# EAGLE design NullAnalyser (EAGLE 5.11)
MPN: C2012Y5V1C105Z/0.85; OC_NEWARK: 90R7762
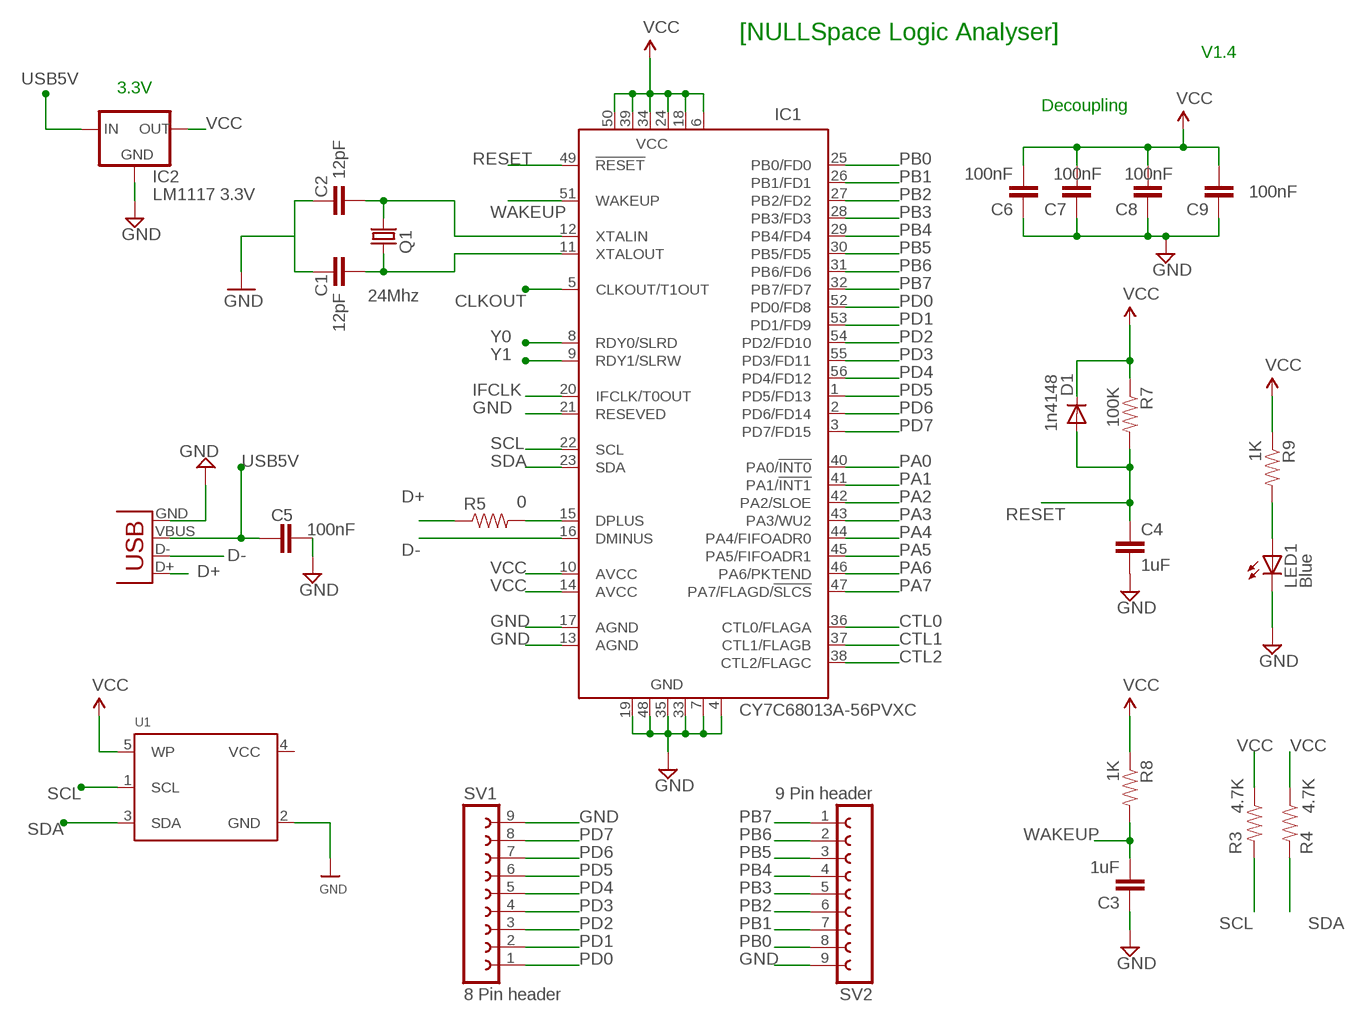
[diagram p0: schematic, sheet 1]

## Parts
C1  12pF  CAP0805  [0805]
C2  12pF  CAP0805  [0805]
C3  1uF  CAP0805  [0805]
C4  1uF  CAP0805  [0805]
C5  100nF  CAP0805  [0805]
C6  100nF  CAP0805  [0805]
C7  100nF  CAP0805  [0805]
C8  100nF  CAP0805  [0805]
C9  100nF  CAP0805  [0805]
D1  1n4148  DIODESOD  [SOD-323]
IC1  CY7C68013A-56PVXC  [SSOP56]
IC2  LM1117 3.3V  LM1117  [SOT223]
LED1  Blue  LED1206  [LED-1206]
Q1  24Mhz  CRYSTALTWO-PADTWO-PAD  [CRYSTAL-SMD-TWO-PAD]
R3  4.7K  RESISTOR  [0805]
R4  4.7K  RESISTOR  [0805]
R5  0  RESISTOR1206  [1206]
R7  100K  RESISTOR  [0805]
R8  1K  RESISTOR  [0805]
R9  1K  RESISTOR  [0805]
SV1  8 Pin header  FE09-1  [FE09]
SV2  9 Pin header  FE09-1  [FE09]
U1  MCP24AA32  [SOT23-5]
X1  USBSMD  [USB-MINIB]

## Nets
CLKOUT: IC1.5(CLKOUT/T1OUT)
CTL0: IC1.36(CTL0/FLAGA)
CTL1: IC1.37(CTL1/FLAGB)
CTL2: IC1.38(CTL2/FLAGC)
D+: R5.1 X1.D+
D+C: IC1.15(DPLUS) R5.2
D-: IC1.16(DMINUS) X1.D-
GND: C1.1 C2.2 C3.1 C4.2 C5.2 C6.1 C7.1 C8.1 C9.1 IC1.4(GND) IC1.7(GND) IC1.13(AGND) IC1.17(AGND) IC1.19(GND) IC1.21(RESEVED) IC1.33(GND) IC1.35(GND) IC1.48(GND) IC2.1(GND) LED1.C SV1.9 SV2.9 U1.2(GND) X1.GND
IFCLK: IC1.20(IFCLK/T0OUT)
N$2: LED1.A R9.2
N$10: C2.1 IC1.12(XTALIN) Q1.2
N$11: C1.2 IC1.11(XTALOUT) Q1.1
PA0: IC1.40(PA0/!INT0)
PA1: IC1.41(PA1/!INT1)
PA2: IC1.42(PA2/SLOE)
PA3: IC1.43(PA3/WU2)
PA4: IC1.44(PA4/FIFOADR0)
PA5: IC1.45(PA5/FIFOADR1)
PA6: IC1.46(PA6/PKTEND)
PA7: IC1.47(PA7/FLAGD/!SLCS)
PB0: IC1.25(PB0/FD0) SV2.8
PB1: IC1.26(PB1/FD1) SV2.7
PB2: IC1.27(PB2/FD2) SV2.6
PB3: IC1.28(PB3/FD3) SV2.5
PB4: IC1.29(PB4/FD4) SV2.4
PB5: IC1.30(PB5/FD5) SV2.3
PB6: IC1.31(PB6/FD6) SV2.2
PB7: IC1.32(PB7/FD7) SV2.1
PD0: IC1.52(PD0/FD8) SV1.1
PD1: IC1.53(PD1/FD9) SV1.2
PD2: IC1.54(PD2/FD10) SV1.3
PD3: IC1.55(PD3/FD11) SV1.4
PD4: IC1.56(PD4/FD12) SV1.5
PD5: IC1.1(PD5/FD13) SV1.6
PD6: IC1.2(PD6/FD14) SV1.7
PD7: IC1.3(PD7/FD15) SV1.8
RESET: C4.1 D1.2(A) IC1.49(!RESET) R7.2
SCL: IC1.22(SCL) R3.2 U1.1(SCL)
SDA: IC1.23(SDA) R4.2 U1.3(SDA)
USB5V: C5.1 IC2.3(IN) X1.VBUS
VCC [power]: C6.2 C7.2 C8.2 C9.2 D1.1(C) IC1.6(VCC) IC1.10(AVCC) IC1.14(AVCC) IC1.18(VCC) IC1.24(VCC) IC1.34(VCC) IC1.39(VCC) IC1.50(VCC) IC2.2(OUT) R3.1 R4.1 R7.1 R8.1 R9.1 U1.5(WP)
WAKEUP: C3.2 IC1.51(WAKEUP) R8.2
Y0: IC1.8(RDY0/SLRD)
Y1: IC1.9(RDY1/SLRW)
Unconnected: U1.4(VCC)

## Notes on the sheet
- [NULLSpace Logic Analyser]
- V1.4
- 3.3V
- Decoupling

## Library data of the parts
C1-C9 = SparkFun:CAP: Capacitor Standard 0603 ceramic capacitor, and 0.1" leaded capacitor.
D1 = SparkFun:DIODE: Diode These are standard reverse protection diodes and small signal diodes. SMA package can handle up to about 1A. SOD-323 can handle about 200mA. What the SOD-323 package when ordering, there are some mfgs out there that are 5-pin packages.
IC1 = cypress:CY7C6801*A-56: EZ-USB FX2LP (TM) USB Microcontroller Source: http://www.cypress.com .. cy7c68013a_5.pdf; MF: CYPRESS SEMICONDUCTOR CORPORAT; MPN: CY7C68013A-56PVXC; OC_FARNELL: 1269134; OC_NEWARK: 19M7114
IC2 = v-reg-3:LM1117
LED1 = SparkFun:LED: LEDs Standard schematic elements and footprints for 5mm, 3mm, 1206, and 0603 sized LEDs. 5mm - Spark Fun Electronics SKU : COM-00529 (and others)
Q1 = NullAnalyser:CRYSTAL: Crystals Various standard crystals. Proven footprints. Spark Fun Electronics SKU : COM-00534
R3-R5 R7-R9 = SparkFun:RESISTOR: Resistor Basic schematic elements and footprints for 0603, 1206, and PTH 1/10th watt (small) resistors.
SV1 SV2 = NullAnalyser:FE09-1: FEMALE HEADER; OC_FARNELL: unknown; OC_NEWARK: unknown
U1 = microbuilder:MCP24AA32: Microchip 32K (4K x 8) 1.8V I2C EEPROM SOT23-5 [Digikey: 24AA32AFT-I/OTCT-ND]
X1 = SparkFun:USB: USB Connectors USB-B-PTH is fully proven SKU : PRT-00139 USB-miniB is fully proven SKU : PRT-00587 USB-A-PCB is untested. USB-A-H is throughly reviewed, but untested. Spark Fun Electronics SKU : PRT-00437 USB-B-SMT is throughly reviewed, but untested. Needs silkscreen touching up. USB-A-S has not been used/tested USB-MB-H has not been used/tested

## Net classes
0 default: width 0.203 mm
1 power: width 0.356 mm

## Board
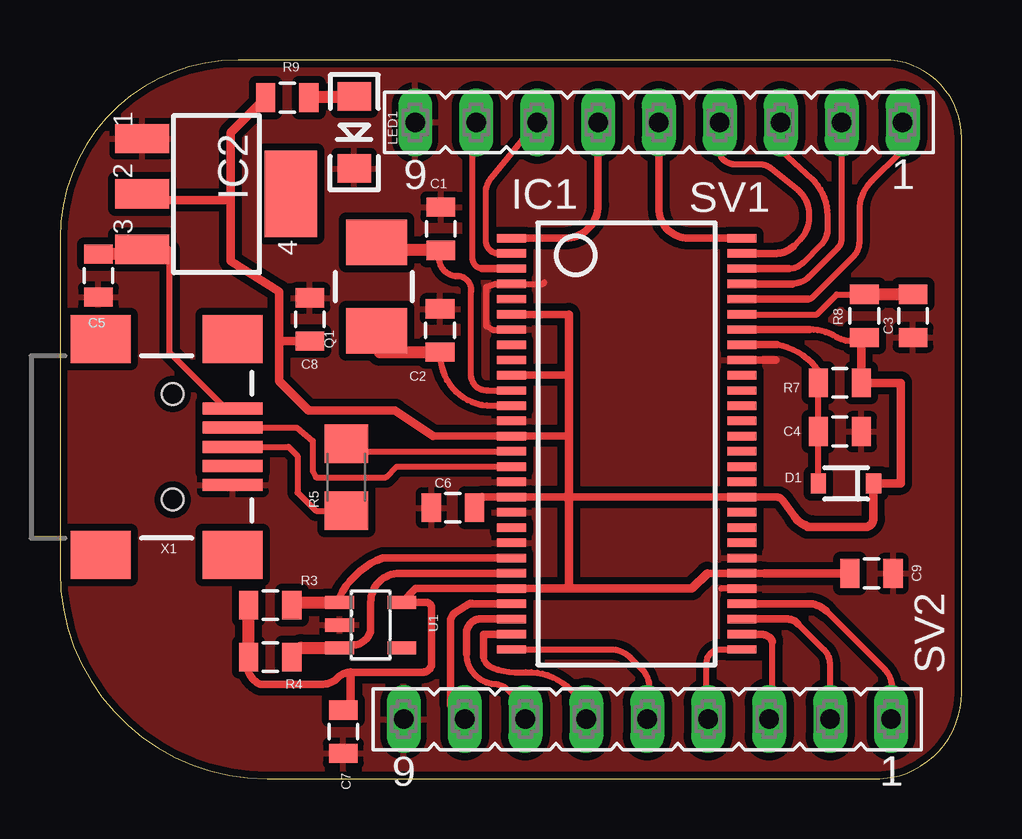
[diagram p1: board, top side]

Size 37.59 x 29.97 mm. Coordinates in mm from the lower left corner, seen from the top.
Outline: 7.42,29.97 arc90 0,22.55 0,8.63 arc90 8.63,0 34,0 arc90 37.59,3.59 37.59,26.72 arc90 34.34,29.97 7.42,29.97
Copper layers 1: Top 0.0356mm
Design rules "SparkFun-mod *": minimum track width 10mil, minimum drill 20mil, track to track 12mil, track to pad 12mil, pad to pad 8mil, via to via 8mil, smd to smd 8mil, copper to edge 12mil, drill to drill 8mil, minimum pad ring 12mil, minimum via ring 10mil, stop-mask expansion 4mil, vias tented up to drill 25mil, thermal gap 10mil
Milling: 9 lines

### Footprints (pad centres in the part's own frame; a part is rotated, then mirrored left to right if it is on the bottom)
0805 = smd 0.8 x 1.2: 1 -0.9,0; 2 0.9,0
SOD-323 = smd 0.63 x 0.83: 1 -1.15,0; 2 1.15,0
SSOP56 = smd 0.35 x 1.2: 1 -8.572,-4.8; 2 -7.938,-4.8; 3 -7.303,-4.8; 4 -6.668,-4.8; 5 -6.032,-4.8; 6 -5.397,-4.8; 7 -4.763,-4.8; 8 -4.128,-4.8; 9 -3.493,-4.8; 10 -2.857,-4.8; 11 -2.223,-4.8; 12 -1.587,-4.8; 13 -0.953,-4.8; 14 -0.318,-4.8; 15 0.318,-4.8; 16 0.953,-4.8; 17 1.587,-4.8; 18 2.223,-4.8; 19 2.857,-4.8; 20 3.493,-4.8; 21 4.128,-4.8; 22 4.763,-4.8; 23 5.397,-4.8; 24 6.032,-4.8; 25 6.668,-4.8; 26 7.303,-4.8; 27 7.938,-4.8; 28 8.572,-4.8; 29 8.572,4.8; 30 7.938,4.8; 31 7.303,4.8; 32 6.668,4.8; 33 6.032,4.8; 34 5.397,4.8; 35 4.763,4.8; 36 4.128,4.8; 37 3.493,4.8; 38 2.857,4.8; 39 2.223,4.8; 40 1.587,4.8; 41 0.953,4.8; 42 0.318,4.8; 43 -0.318,4.8; 44 -0.953,4.8; 45 -1.587,4.8; 46 -2.223,4.8; 47 -2.857,4.8; 48 -3.493,4.8; 49 -4.128,4.8; 50 -4.763,4.8; 51 -5.397,4.8; 52 -6.032,4.8; 53 -6.668,4.8; 54 -7.303,4.8; 55 -7.938,4.8; 56 -8.572,4.8
SOT223 = smd 1.219 x 2.235: 1 -2.311,-3.099; 2 0,-3.099; 3 2.311,-3.099 | smd 3.6 x 2.2: 4 0,3.099
LED-1206 = smd 1.2 x 1.4: A -1.5,0; C 1.5,0
CRYSTAL-SMD-TWO-PAD = smd 1.9 x 2.54: 1 -1.85,0.12; 2 1.85,0.12
1206 = smd 1.6 x 1.8: 1 -1.4,0; 2 1.4,0
FE09 = drill 0.813 long: 1 -10.16,0; 2 -7.62,0; 3 -5.08,0; 4 -2.54,0; 5 0,0; 6 2.54,0; 7 5.08,0; 8 7.62,0; 9 10.16,0
SOT23-5 = smd 0.55 x 1.2: 1 -0.95,-1.3; 2 0,-1.3; 3 0.95,-1.3; 4 0.95,1.3; 5 -0.95,1.3
USB-MINIB = smd 2.5 x 0.5: D+ 2.5,0; D- 2.5,0.8; GND 2.5,-1.6; ID 2.5,-0.8; VBUS 2.5,1.6 | smd 2.5 x 2: GND@1 -3,-4.5; GND@2 -3,4.5; GND@3 2.5,4.5; GND@4 2.5,-4.5 | hole 0.9: 0,2.2; 0,-2.2

### Placement (x,y rotation side)
C1  15.88,22.94 270 top
C2  15.85,18.69 90 top
C3  35.56,19.3 90 top
C4  32.51,14.48 0 top
C5  1.6,20.98 270 top
C6  16.38,11.3 0 top
C7  11.81,1.97 90 top
C8  10.41,19.15 270 top
C9  33.83,8.56 180 top
D1  32.77,12.32 180 top
IC1  23.62,13.97 270 top
IC2  6.53,24.38 270 top
LED1  12.27,26.95 270 top
Q1  13.08,20.52 270 top
R3  8.76,7.24 0 top
R4  8.76,5.08 0 top
R5  11.94,12.57 90 top
R7  32.51,16.51 180 top
R8  33.53,19.3 90 top
R9  9.47,28.4 0 top
SV1  24.97,27.37 180 top
SV2  24.49,2.49 180 top
U1  12.95,6.41 270 top
X1  4.7,13.84 0 top

### Tracks (layer width: path | path; a pad name or v marks a point on that pad's centre or on a via)
D+
  Top 0.254: X1.D+ 9.53,13.84 9.91,13.46 9.91,11.94 10.67,11.18 R5.1
D+C
  Top 0.254: IC1.15 12.26,13.65 arc-90 R5.2
D-
  Top 0.254: X1.D- 9.87,14.64 10.54,14.1 10.54,12.83 10.67,12.57 13.59,12.57 14.03,13.02 IC1.16
GND
  Top 0.254: IC1.33 27.56,7.94 | 20.19,20.7 20.13,20.64 IC1.4 18.15,20.64 17.78,20.52 17.78,18.87 18.03,18.72 18.76,18.72 IC1.7
  Top 0.305: IC1.48 29.84,17.46
  pour Top (isolate 0.305): 37.59,26.85 arc90 34.98,29.98 7.52,30.07 arc90 0,22.58 0,9.18 arc90 9.18,-0.03 33.64,0.11 arc90 37.59,4.08
N$2
  Top 0.254: R9.2 10.43,28.45
  Top 0.508: 10.43,28.45 LED1.A
N$10
  Top 0.254: 16.11,17.66 C2.1 arc93 17.98,15.56 IC1.12 | Q1.2 13.33,17.79
  Top 0.508: 13.33,17.79 C2.1
N$11
  Top 0.254: IC1.11 17.84,16.19 arc-90 17.15,16.76 17.15,20.32 arc90 16.64,20.95 arc-119 C1.2 | 13.54,22.04 Q1.1
  Top 0.508: C1.2 13.54,22.04
PB0
  Top 0.254: SV2.8 16.28,3.07 | 17.22,7.29 17.23,7.3
  Top 0.305: 16.28,3.07 16.28,6.61 arc-43 16.49,6.95 17.05,7.29 arc-53 17.22,7.29 | 17.23,7.3 IC1.25
PB1
  Top 0.254: SV2.7 19.41,2.95 18.54,3.81 18.23,3.94 arc-90 16.95,5.21
  Top 0.305: 16.95,5.21 16.95,6.17 arc-90 17.7,6.67 IC1.26
PB2
  Top 0.254: 17.65,5.09 arc63 18.07,4.62 18.05,4.63 arc27 19.42,4.45 arc-81 SV2.6
  Top 0.305: IC1.27 17.65,6.03 17.65,5.09
PB3
  Top 0.254: IC1.28 22.97,5.4 arc-45 23.76,5.07 24.26,4.57 arc-45 24.56,3.83 24.56,2.56 SV2.5
PB4
  Top 0.254: IC1.29 27.53,5.4 arc90 26.95,4.82 26.95,2.56 SV2.4
PB5
  Top 0.254: 29.69,5.7 29.69,2.62 SV2.3
  Top 0.305: IC1.30 29.2,6.03 arc-45 29.63,5.85 arc-45 29.69,5.7
PB6
  Top 0.254: 32.13,2.67 SV2.2 32.11,4.77 arc45 31.85,5.38 30.77,6.47
  Top 0.305: 30.77,6.47 arc45 30.29,6.67 IC1.31
PB7
  Top 0.254: 31.94,7 34.38,4.56 arc-45 34.67,3.85 34.67,2.52 SV2.1
  Top 0.305: IC1.32 31.21,7.3 arc-45 31.94,7
PD0
  Top 0.254: 31.17,20 arc45 31.4,20.1 33.06,21.76 arc45 33.34,22.42 33.34,23.7 arc-45 33.84,24.94 35.03,26.12 35.15,27.48 SV1.1
  Top 0.305: IC1.52 31.17,20
PD1
  Top 0.254: SV1.2 32.59,22.53 arc-45 32.42,22.13 31.24,20.95 arc-45 30.55,20.66 30.53,20.64
  Top 0.305: IC1.53 30.53,20.64
PD2
  Top 0.254: 30.39,21.27 arc45 30.96,21.51 31.77,22.31 arc45 32.01,22.9 32.01,23.51 arc47 31.35,25.01 30.12,26.16 30.12,27.44 SV1.3
  Top 0.305: IC1.54 30.39,21.27
PD3
  Top 0.254: 30.57,22.2 30.87,22.5 arc45 31.24,23.39 31.24,23.55 arc51 30.77,24.54 29.67,25.44 arc39 29.17,25.61 28.16,25.61 arc-54 27.56,25.92 27.56,27.45 SV1.4
  Top 0.305: IC1.55 29.86,21.91 arc45 30.57,22.2
PD4
  Top 0.305: SV1.5 24.97,23.78 arc90 26.2,22.54 IC1.56
PD5
  Top 0.305: IC1.1 21.05,22.54 arc90 22.43,23.93 SV1.6
PD6
  Top 0.254: SV1.7 17.99,25.08 arc40 17.76,24.42 17.76,22.43 arc90 18.29,21.9 18.31,21.91
  Top 0.305: 18.31,21.91 IC1.2
PD7
  Top 0.254: SV1.8 17.35,26.72 17.2,26.67 17.2,21.72 arc48 17.35,21.38 arc42 17.59,21.29 17.6,21.27
  Top 0.305: 17.6,21.27 IC1.3
RESET
  Top 0.254: 29.89,18.1 arc-45 31.64,16.99 R7.2 C4.1 D1.2
  Top 0.305: 29.89,18.1 IC1.49
SCL
  Top 0.254: R3.2 9.92,7.36 | U1.1 11.65,7.56
  Top 0.305: IC1.22 13.46,9.21 arc45 11.65,7.56
  Top 0.508: 9.92,7.36 U1.1
SDA
  Top 0.254: U1.3 12.07,5.59 | R4.2 10.05,5.46
  Top 0.305: 12.07,5.59 arc90 12.95,6.22 12.95,7.37 arc-90 14.16,8.57 IC1.23
  Top 0.508: 10.05,5.46 U1.3
USB5V
  Top 0.254: X1.VBUS 6.91,15.44 4.57,17.78 4.57,22.07 IC2.3 3.24,21.88
  Top 0.508: 3.24,21.88 C5.1
VCC
  Top 0.254: 31.24,18.73 arc-31 32.39,18.41 arc61 R8.1 arc90 33.41,18.29 | 14.64,7.46 U1.5 arc90 14.38,7.37
  Top 0.305: 21.21,19.37 IC1.6 | 21.21,16.83 IC1.10 | 21.21,14.29 IC1.14 15.56,14.29 | 21.08,11.75 IC1.18 17.6,11.75 | 21.21,11.75 IC1.39 29.87,11.75 arc-55 30.14,11.61 30.64,10.91 | 26.99,8.57 IC1.34 29.36,8.57 | 20,7.94 IC1.24 14.83,7.94 U1.5 | 31.24,18.73 IC1.50 | R4.1 arc90 8.37,3.94 10.89,3.94 arc45 11.59,4.23 arc-45 12.12,4.45 15.11,4.45 arc90 15.49,4.83 15.49,7.11 arc90 15.24,7.37 14.38,7.37
  Top 0.356: R7.1 33.41,18.29 | 21.21,19.37 21.21,16.83 21.21,14.29 21.21,11.75 | 21.21,11.75 21.08,11.75 | 26.99,8.57 26.35,7.94 21.21,7.94 | 30.64,10.91 arc55 31.44,10.5 | 31.44,10.5 33.55,10.5 arc90 33.91,10.86 D1.1 35.05,12.32 35.05,16.51 R7.1 | R7.1 33.5,16.6 | 20,7.94 21.21,7.94 | 21.21,7.94 21.21,11.75 | 9.14,18.16 9.14,20.32 7.11,21.59 7.11,24.13 | C8.2 9.24,18.25 arc90 9.14,18.16 | C7.2 12.12,2.87 12.12,4.45 | 17.6,11.75 C6.2 | 31.44,10.5 31.16,10.5 | 29.36,8.57 32.93,8.57 C9.2 | 15.56,14.29 13.97,15.37 10.36,15.37 9.14,16.59 9.14,18.16 | R9.1 7.11,26.94 7.11,24.13 | IC2.2 3.68,24.13 7.11,24.13
  Top 0.508: R4.1 R3.1
WAKEUP
  Top 0.254: IC1.51 31.56,19.37 32.39,20.19 33.52,20.19 R8.2
  Top 0.508: R8.2 C3.2

### Text on the board
_tsilk: [NULLSpace] | 1 | charliex | 032.la | 1